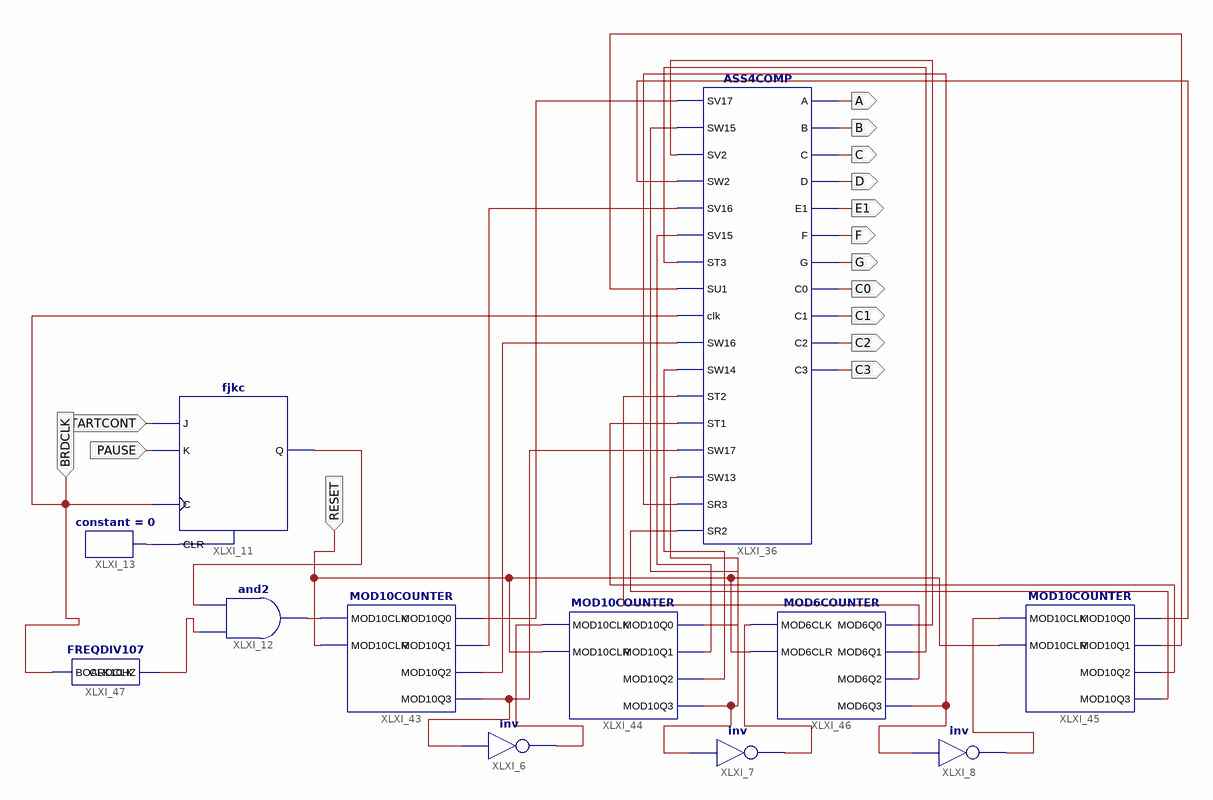
[diagram p0: schematic sheet 1]
// Xilinx ISE schematic MAIN_A5.sch (spartan6) as structural Verilog: 12 symbols, 15 ports
module MAIN_A5 (
  input  RESET,
  input  BRDCLK,
  input  STARTCONT,
  input  PAUSE,
  output A,
  output B,
  output C,
  output D,
  output E1,
  output F,
  output G,
  output C0,
  output C1,
  output C2,
  output C3
);

  wire XLXN_2, XLXN_3, XLXN_4, XLXN_5, XLXN_7, XLXN_9, XLXN_10, XLXN_11, XLXN_15, XLXN_52, XLXN_53, XLXN_54,
       XLXN_55, XLXN_56, XLXN_57, XLXN_59, XLXN_60, XLXN_61, XLXN_62, XLXN_63, XLXN_64, XLXN_65, XLXN_66;

  not XLXI_6 (XLXN_3, XLXN_2);
  not XLXI_7 (XLXN_5, XLXN_4);
  not XLXI_8 (XLXN_7, XLXN_62);
  and XLXI_12 (XLXN_9, XLXN_11, XLXN_10);
  constant #(.CValue("0")) XLXI_13 (.O(XLXN_15));
  fjkc XLXI_11 (.C(BRDCLK), .CLR(XLXN_15), .J(STARTCONT), .K(PAUSE), .Q(XLXN_10));
  ASS4COMP XLXI_36 (
    .A(A), .B(B), .C(C), .C0(C0), .C1(C1), .C2(C2), .C3(C3), .clk(BRDCLK), .D(D), .E1(E1), .F(F), .G(G),
    .SR2(XLXN_66), .SR3(XLXN_62), .ST1(XLXN_65), .ST2(XLXN_61), .ST3(XLXN_60), .SU1(XLXN_64), .SV15(XLXN_56),
    .SV16(XLXN_53), .SV17(XLXN_52), .SV2(XLXN_59), .SW13(XLXN_4), .SW14(XLXN_57), .SW15(XLXN_55),
    .SW16(XLXN_54), .SW17(XLXN_2), .SW2(XLXN_63));
  MOD10COUNTER XLXI_43 (
    .MOD10CLK(XLXN_9), .MOD10CLR(RESET), .MOD10Q0(XLXN_52), .MOD10Q1(XLXN_53), .MOD10Q2(XLXN_54),
    .MOD10Q3(XLXN_2));
  MOD10COUNTER XLXI_44 (
    .MOD10CLK(XLXN_3), .MOD10CLR(RESET), .MOD10Q0(XLXN_55), .MOD10Q1(XLXN_56), .MOD10Q2(XLXN_57),
    .MOD10Q3(XLXN_4));
  MOD10COUNTER XLXI_45 (
    .MOD10CLK(XLXN_7), .MOD10CLR(RESET), .MOD10Q0(XLXN_63), .MOD10Q1(XLXN_64), .MOD10Q2(XLXN_65),
    .MOD10Q3(XLXN_66));
  MOD6COUNTER XLXI_46 (
    .MOD6CLK(XLXN_5), .MOD6CLR(RESET), .MOD6Q0(XLXN_59), .MOD6Q1(XLXN_60), .MOD6Q2(XLXN_61), .MOD6Q3(XLXN_62));
  FREQDIV107 XLXI_47 (.BOARDCLK(BRDCLK), .CLK10HZ(XLXN_11));
endmodule
